# EAGLE design OpenChair (EAGLE 7.6.0)

## Sheet 1 of 2
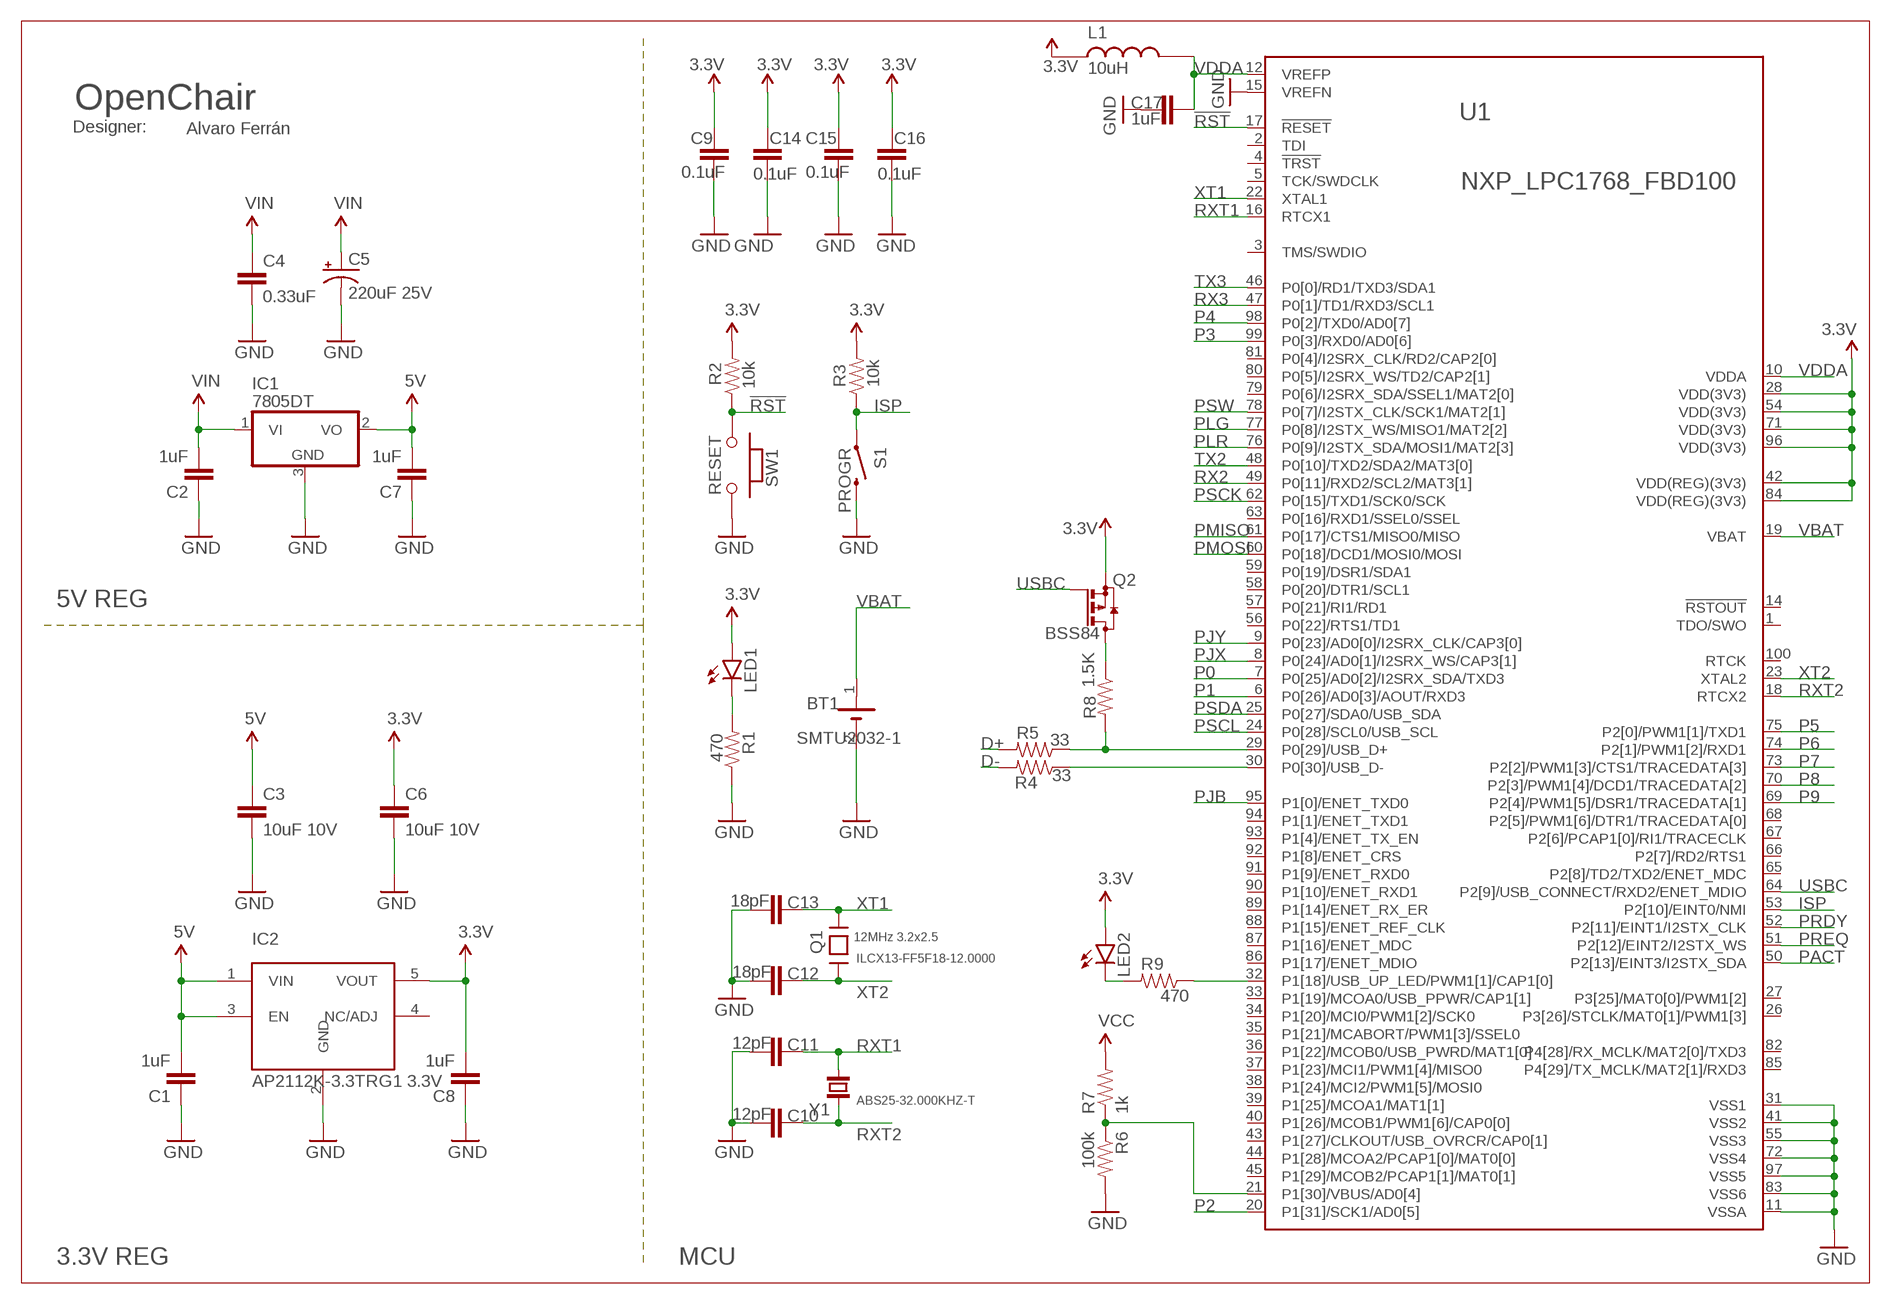
[diagram p0: schematic, sheet 1]

### Parts
BT1  SMTU2032-1  [RENATA_SMTU2032-1]
C1  1uF  CAP0603-CAP  [0603-CAP]
C2  1uF  CAP0603-CAP  [0603-CAP]
C3  10uF 10V  CAP0603-CAP  [0603-CAP]
C4  0.33uF  CAP0805  [0805]
C5  220uF 25V  CAP_POLPTH1  [CPOL-RADIAL-100UF-25V]
C6  10uF 10V  CAP0603-CAP  [0603-CAP]
C7  1uF  CAP0603-CAP  [0603-CAP]
C8  1uF  CAP0603-CAP  [0603-CAP]
C9  0.1uF  CAP0402-CAP  [0402-CAP]
C10  12pF  CAP0402-CAP  [0402-CAP]
C11  12pF  CAP0402-CAP  [0402-CAP]
C12  18pF  CAP0402-CAP  [0402-CAP]
C13  18pF  CAP0402-CAP  [0402-CAP]
C14  0.1uF  CAP0402-CAP  [0402-CAP]
C15  0.1uF  CAP0402-CAP  [0402-CAP]
C16  0.1uF  CAP0402-CAP  [0402-CAP]
C17  1uF  CAP0603-CAP  [0603-CAP]
IC1  7805DT  [TO252]
IC2  AP2112K-3.3TRG1 3.3V  5PIN_REG  [SOT23-5]
L1  10uH  L_L  [L0603]
LED1  LED0603  [LED-0603]
LED2  LED0603  [LED-0603]
Q1  12MHz 3.2x2.5  CRYSTAL3.2X2.5  [CRYSTAL_3.2X2.5]
Q2  BSS84  [SOT23]
R1  470  RESISTOR0402-RES  [0402-RES]
R2  10k  RESISTOR0402-RES  [0402-RES]
R3  10k  RESISTOR0402-RES  [0402-RES]
R4  33  RESISTOR0402-RES  [0402-RES]
R5  33  RESISTOR0402-RES  [0402-RES]
R6  100k  RESISTOR0402-RES  [0402-RES]
R7  1k  RESISTOR0402-RES  [0402-RES]
R8  1.5K  RESISTOR0402-RES  [0402-RES]
R9  470  RESISTOR0402-RES  [0402-RES]
S1  PROGR  SWITCH-MOMENTARY-2SIDE_EZ  [TACTILE-PTH-SIDEEZ]
SW1  RESET  PB157  [157SW]
U1  NXP_LPC1768_FBD100  [QFP50P1600X1600X160-100N]
Y1  ABS25  [ABS25]

### Nets
3.3V: C6.1 C8.2 C9.1 C14.1 C15.1 C16.1 IC2.5(VOUT) L1.P$1 LED1.A LED2.A Q2.2(S) R2.2 R3.2 U1.28(VDD(3V3)) U1.42(VDD(REG)(3V3)) U1.54(VDD(3V3)) U1.71(VDD(3V3)) U1.84(VDD(REG)(3V3)) U1.96(VDD(3V3)) ; also sheet 2
5V: C1.2 C3.1 C7.2 IC1.2(VO) IC2.1(VIN) IC2.3(EN) ; also sheet 2
!RST: R2.1 SW1.1 U1.17(!RESET)
D+: R5.2 ; also sheet 2
D-: R4.2 ; also sheet 2
GND: BT1.2(-) C1.1 C2.1 C3.2 C4.2 C5.2(-) C6.2 C7.1 C8.1 C9.2 C10.2 C11.2 C12.2 C13.2 C14.2 C15.2 C16.2 C17.1 IC1.3(GND) IC2.2(GND) R1.1 R6.2 S1.2 SW1.2 U1.11(VSSA) U1.15(VREFN) U1.31(VSS1) U1.41(VSS2) U1.55(VSS3) U1.72(VSS4) U1.83(VSS6) U1.97(VSS5) ; also sheet 2
ISP: R3.1 S1.1 U1.53(P2[10]/EINT0/NMI)
N$7: LED1.C R1.2
N$12: R6.1 R7.1 U1.21(P1[30]/VBUS/AD0[4])
N$13: R5.1 R8.2 U1.29(P0[29]/USB_D+)
N$14: R9.1 U1.32(P1[18]/USB_UP_LED/PWM1[1]/CAP1[0])
N$15: LED2.C R9.2
N$16: R4.1 U1.30(P0[30]/USB_D-)
N$17: Q2.3(D) R8.1
P0: U1.7(P0[25]/AD0[2]/I2SRX_SDA/TXD3) ; also sheet 2
P1: U1.6(P0[26]/AD0[3]/AOUT/RXD3) ; also sheet 2
P2: U1.20(P1[31]/SCK1/AD0[5]) ; also sheet 2
P3: U1.99(P0[3]/RXD0/AD0[6]) ; also sheet 2
P4: U1.98(P0[2]/TXD0/AD0[7]) ; also sheet 2
P5: U1.75(P2[0]/PWM1[1]/TXD1) ; also sheet 2
P6: U1.74(P2[1]/PWM1[2]/RXD1) ; also sheet 2
P7: U1.73(P2[2]/PWM1[3]/CTS1/TRACEDATA[3]) ; also sheet 2
P8: U1.70(P2[3]/PWM1[4]/DCD1/TRACEDATA[2]) ; also sheet 2
P9: U1.69(P2[4]/PWM1[5]/DSR1/TRACEDATA[1]) ; also sheet 2
PACT: U1.50(P2[13]/EINT3/I2STX_SDA) ; also sheet 2
PJB: U1.95(P1[0]/ENET_TXD0) ; also sheet 2
PJX: U1.8(P0[24]/AD0[1]/I2SRX_WS/CAP3[1]) ; also sheet 2
PJY: U1.9(P0[23]/AD0[0]/I2SRX_CLK/CAP3[0]) ; also sheet 2
PLG: U1.77(P0[8]/I2STX_WS/MISO1/MAT2[2]) ; also sheet 2
PLR: U1.76(P0[9]/I2STX_SDA/MOSI1/MAT2[3]) ; also sheet 2
PMISO: U1.61(P0[17]/CTS1/MISO0/MISO) ; also sheet 2
PMOSI: U1.60(P0[18]/DCD1/MOSI0/MOSI) ; also sheet 2
PRDY: U1.52(P2[11]/EINT1/I2STX_CLK) ; also sheet 2
PREQ: U1.51(P2[12]/EINT2/I2STX_WS) ; also sheet 2
PSCK: U1.62(P0[15]/TXD1/SCK0/SCK) ; also sheet 2
PSCL: U1.24(P0[28]/SCL0/USB_SCL) ; also sheet 2
PSDA: U1.25(P0[27]/SDA0/USB_SDA) ; also sheet 2
PSW: U1.78(P0[7]/I2STX_CLK/SCK1/MAT2[1]) ; also sheet 2
RX2: U1.49(P0[11]/RXD2/SCL2/MAT3[1]) ; also sheet 2
RX3: U1.47(P0[1]/TD1/RXD3/SCL1)
RXT1: C11.1 U1.16(RTCX1) Y1.1
RXT2: C10.1 U1.18(RTCX2) Y1.4
TX2: U1.48(P0[10]/TXD2/SDA2/MAT3[0]) ; also sheet 2
TX3: U1.46(P0[0]/RD1/TXD3/SDA1) ; also sheet 2
USBC: Q2.1(G) U1.64(P2[9]/USB_CONNECT/RXD2/ENET_MDIO)
VBAT: BT1.1(+) U1.19(VBAT)
VCC: R7.2 ; also sheet 2
VDDA: C17.2 L1.P$2 U1.10(VDDA) U1.12(VREFP)
VIN: C2.2 C4.1 C5.1(+) IC1.1(VI) ; also sheet 2
XT1: C13.1 Q1.3 U1.22(XTAL1)
XT2: C12.1 Q1.1 U1.23(XTAL2)
Unconnected: IC2.4(NC/ADJ) U1.1(TDO/SWO) U1.2(TDI) U1.3(TMS/SWDIO) U1.4(!TRST) U1.5(TCK/SWDCLK) U1.14(!RSTOUT) U1.26(P3[26]/STCLK/MAT0[1]/PWM1[3]) U1.27(P3[25]/MAT0[0]/PWM1[2]) U1.33(P1[19]/MCOA0/USB_PPWR/CAP1[1]) U1.34(P1[20]/MCI0/PWM1[2]/SCK0) U1.35(P1[21]/MCABORT/PWM1[3]/SSEL0) U1.36(P1[22]/MCOB0/USB_PWRD/MAT1[0]) U1.37(P1[23]/MCI1/PWM1[4]/MISO0) U1.38(P1[24]/MCI2/PWM1[5]/MOSI0) U1.39(P1[25]/MCOA1/MAT1[1]) U1.40(P1[26]/MCOB1/PWM1[6]/CAP0[0]) U1.43(P1[27]/CLKOUT/USB_OVRCR/CAP0[1]) U1.44(P1[28]/MCOA2/PCAP1[0]/MAT0[0]) U1.45(P1[29]/MCOB2/PCAP1[1]/MAT0[1]) U1.56(P0[22]/RTS1/TD1) U1.57(P0[21]/RI1/RD1) U1.58(P0[20]/DTR1/SCL1) U1.59(P0[19]/DSR1/SDA1) U1.63(P0[16]/RXD1/SSEL0/SSEL) U1.65(P2[8]/TD2/TXD2/ENET_MDC) U1.66(P2[7]/RD2/RTS1) U1.67(P2[6]/PCAP1[0]/RI1/TRACECLK) U1.68(P2[5]/PWM1[6]/DTR1/TRACEDATA[0]) U1.79(P0[6]/I2SRX_SDA/SSEL1/MAT2[0]) U1.80(P0[5]/I2SRX_WS/TD2/CAP2[1]) U1.81(P0[4]/I2SRX_CLK/RD2/CAP2[0]) U1.82(P4[28]/RX_MCLK/MAT2[0]/TXD3) U1.85(P4[29]/TX_MCLK/MAT2[1]/RXD3) U1.86(P1[17]/ENET_MDIO) U1.87(P1[16]/ENET_MDC) U1.88(P1[15]/ENET_REF_CLK) U1.89(P1[14]/ENET_RX_ER) U1.90(P1[10]/ENET_RXD1) U1.91(P1[9]/ENET_RXD0) U1.92(P1[8]/ENET_CRS) U1.93(P1[4]/ENET_TX_EN) U1.94(P1[1]/ENET_TXD1) U1.100(RTCK)

### Notes on the sheet
- OpenChair
- Designer: | Alvaro Ferrán
- 5V REG
- ILCX13-FF5F18-12.0000
- ABS25-32.000KHZ-T
- 3.3V REG | MCU

## Sheet 2 of 2
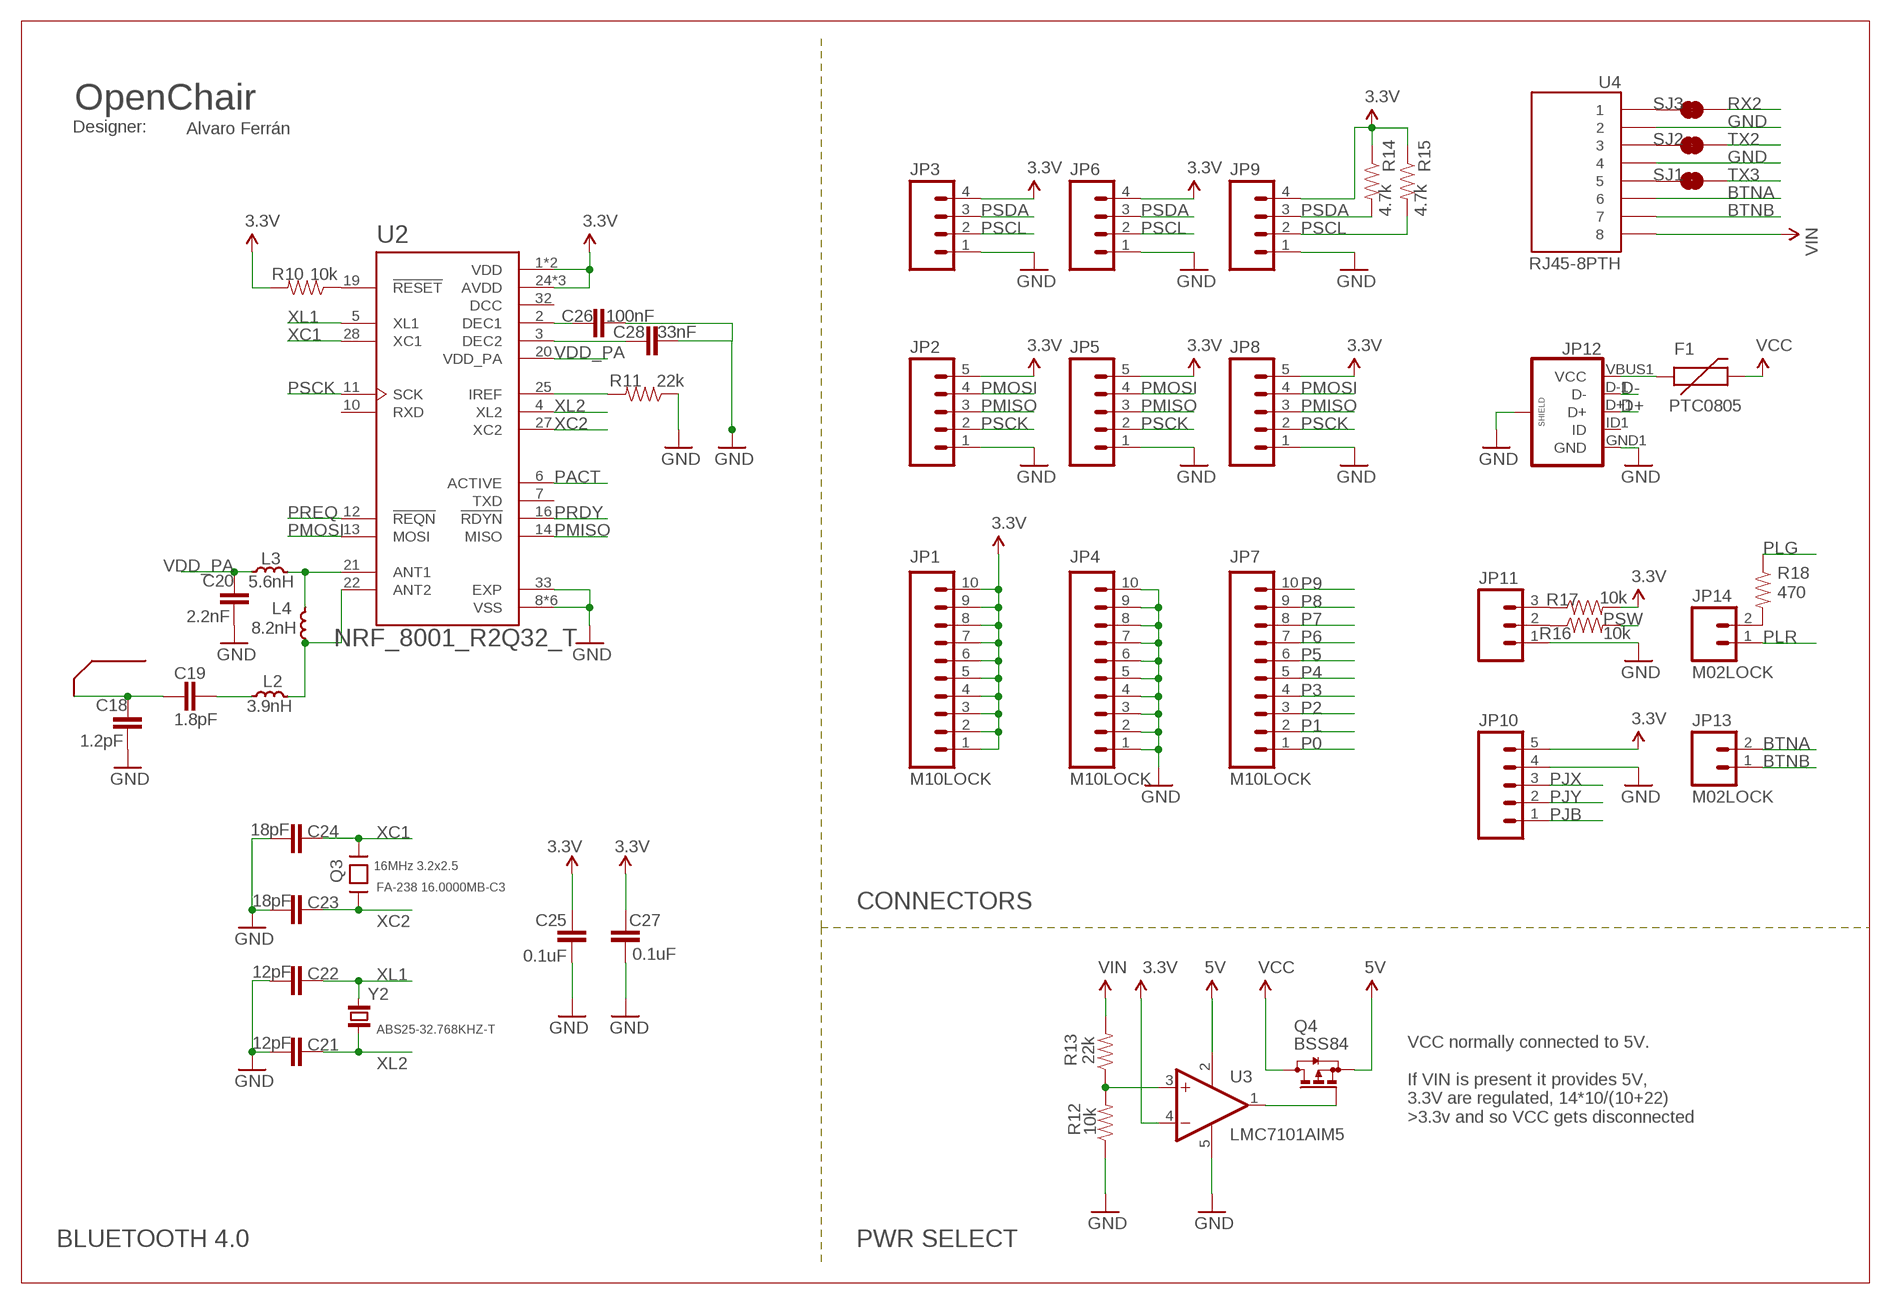
[diagram p1: schematic, sheet 2]

### Parts
ANT1  NRF_ANTENNA  [NRF_ANTENNA]
C18  1.2pF  CAP0402-CAP  [0402-CAP]
C19  1.8pF  CAP0402-CAP  [0402-CAP]
C20  2.2nF  CAP0402-CAP  [0402-CAP]
C21  12pF  CAP0402-CAP  [0402-CAP]
C22  12pF  CAP0402-CAP  [0402-CAP]
C23  18pF  CAP0402-CAP  [0402-CAP]
C24  18pF  CAP0402-CAP  [0402-CAP]
C25  0.1uF  CAP0402-CAP  [0402-CAP]
C26  100nF  CAP0402-CAP  [0402-CAP]
C27  0.1uF  CAP0402-CAP  [0402-CAP]
C28  33nF  CAP0402-CAP  [0402-CAP]
F1  PTC0805  [0805]
JP1  M10LOCK  [1X10_LOCK]
JP2  M05LOCK  [1X05_LOCK]
JP3  M04LOCK  [1X04_LOCK]
JP4  M10LOCK  [1X10_LOCK]
JP5  M05LOCK  [1X05_LOCK]
JP6  M04LOCK  [1X04_LOCK]
JP7  M10LOCK  [1X10_LOCK]
JP8  M05LOCK  [1X05_LOCK]
JP9  M04LOCK  [1X04_LOCK]
JP10  M05LOCK  [1X05_LOCK]
JP11  M03LOCK  [1X03_LOCK]
JP12  USB_MICROB_PLUGCONN-11752  [USB-B-MICRO-SMD_V03]
JP13  M02LOCK  [1X02_LOCK]
JP14  M02LOCK  [1X02_LOCK]
L2  3.9nH  L0402  [0402]
L3  5.6nH  L0402  [0402]
L4  8.2nH  L0402  [0402]
Q3  16MHz 3.2x2.5  CRYSTAL3.2X2.5  [CRYSTAL_3.2X2.5]
Q4  BSS84  [SOT23]
R10  10k  RESISTOR0402-RES  [0402-RES]
R11  22k  RESISTOR0402-RES  [0402-RES]
R12  10k  RESISTOR0402-RES  [0402-RES]
R13  22k  RESISTOR0402-RES  [0402-RES]
R14  4.7k  RESISTOR0402-RES  [0402-RES]
R15  4.7k  RESISTOR0402-RES  [0402-RES]
R16  10k  RESISTOR0402-RES  [0402-RES]
R17  10k  RESISTOR0402-RES  [0402-RES]
R18  470  RESISTOR0402-RES  [0402-RES]
SJ1  JUMPER-PAD-2-NC_BY_TRACE  [PAD-JUMPER-2-NC_BY_TRACE_YES_SILK]
SJ2  JUMPER-PAD-2-NC_BY_TRACE  [PAD-JUMPER-2-NC_BY_TRACE_YES_SILK]
SJ3  JUMPER-PAD-2-NC_BY_TRACE  [PAD-JUMPER-2-NC_BY_TRACE_YES_SILK]
U2  NRF_8001_R2Q32_T  [QFN50P500X500X90-33N]
U3  LMC7101AIM5  [SOT23-5]
U4  RJ45-8PTH  [RJ45-8]
Y2  ABS25-32.768kHz  ABS25  [ABS25]

### Nets
3.3V: C25.1 C27.1 JP1.1 JP1.2 JP1.3 JP1.4 JP1.5 JP1.6 JP1.7 JP1.8 JP1.9 JP1.10 JP2.5 JP3.4 JP5.5 JP6.4 JP8.5 JP9.4 JP10.5 R10.2 R14.1 R15.1 R17.2 U2.1(VDD) U2.9(VDD) U2.24(AVDD) U2.26(AVDD) U2.29(AVDD) U3.4(-IN) ; also sheet 1
5V: Q4.2(S) U3.2(V+) ; also sheet 1
BTNA: JP13.2 U4.6
BTNB: JP13.1 U4.7
D+: JP12.D+1(D+) ; also sheet 1
D-: JP12.D-1(D-) ; also sheet 1
GND: C18.2 C20.2 C21.2 C22.2 C23.2 C24.2 C25.2 C26.1 C27.2 C28.1 JP2.1 JP3.1 JP4.1 JP4.2 JP4.3 JP4.4 JP4.5 JP4.6 JP4.7 JP4.8 JP4.9 JP4.10 JP5.1 JP6.1 JP8.1 JP9.1 JP10.4 JP11.1 JP12.GND1(GND) JP12.SHIELD1(SHIELD) JP12.SHIELD2(SHIELD) JP12.SHIELD3(SHIELD) R11.1 R12.1 U2.8(VSS) U2.17(VSS) U2.18(VSS) U2.23(VSS) U2.30(VSS) U2.31(VSS) U2.33(EXP) U3.5(V-) U4.2 U4.4 ; also sheet 1
N$1: JP14.2 R18.2
N$2: SJ3.1 U4.1
N$3: SJ2.1 U4.3
N$4: SJ1.1 U4.5
N$5: F1.1 JP12.VBUS1(VCC)
N$6: JP11.2 R16.1
N$11: JP11.3 R17.1
N$18: Q4.1(G) U3.1(OUT)
N$20: R12.2 R13.1 U3.3(+IN)
N$21: R11.2 U2.25(IREF)
N$22: C26.2 U2.2(DEC1)
N$23: C28.2 U2.3(DEC2)
N$24: R10.1 U2.19(!RESET)
N$25: L2.2 L4.1 U2.22(ANT2)
N$26: L3.2 L4.2 U2.21(ANT1)
N$29: C19.1 L2.1
N$30: ANT1.P$1 C18.1 C19.2
P0: JP7.1 ; also sheet 1
P1: JP7.2 ; also sheet 1
P2: JP7.3 ; also sheet 1
P3: JP7.4 ; also sheet 1
P4: JP7.5 ; also sheet 1
P5: JP7.6 ; also sheet 1
P6: JP7.7 ; also sheet 1
P7: JP7.8 ; also sheet 1
P8: JP7.9 ; also sheet 1
P9: JP7.10 ; also sheet 1
PACT: U2.6(ACTIVE) ; also sheet 1
PJB: JP10.1 ; also sheet 1
PJX: JP10.3 ; also sheet 1
PJY: JP10.2 ; also sheet 1
PLG: R18.1 ; also sheet 1
PLR: JP14.1 ; also sheet 1
PMISO: JP2.3 JP5.3 JP8.3 U2.14(MISO) ; also sheet 1
PMOSI: JP2.4 JP5.4 JP8.4 U2.13(MOSI) ; also sheet 1
PRDY: U2.16(!RDYN) ; also sheet 1
PREQ: U2.12(!REQN) ; also sheet 1
PSCK: JP2.2 JP5.2 JP8.2 U2.11(SCK) ; also sheet 1
PSCL: JP3.2 JP6.2 JP9.2 R15.2 ; also sheet 1
PSDA: JP3.3 JP6.3 JP9.3 R14.2 ; also sheet 1
PSW: R16.2 ; also sheet 1
RX2: SJ3.2 ; also sheet 1
TX2: SJ2.2 ; also sheet 1
TX3: SJ1.2 ; also sheet 1
VCC: F1.2 Q4.3(D) ; also sheet 1
VDD_PA: C20.1 L3.1 U2.20(VDD_PA)
VIN: R13.2 U4.8 ; also sheet 1
XC1: C24.1 Q3.3 U2.28(XC1)
XC2: C23.1 Q3.1 U2.27(XC2)
XL1: C22.1 U2.5(XL1) Y2.4
XL2: C21.1 U2.4(XL2) Y2.1
Unconnected: JP12.ID1(ID) U2.7(TXD) U2.10(RXD)

### Notes on the sheet
- OpenChair
- Designer: | Alvaro Ferrán
- FA-238 16.0000MB-C3
- CONNECTORS
- ABS25-32.768KHZ-T
- VCC normally connected to 5V.
  
  If VIN is present it provides 5V, 
  3.3V are regulated, 14*10/(10+22)
  >3.3v and so VCC gets disconnected
- BLUETOOTH 4.0 | PWR SELECT

## Power pins joined to a net without a drawn wire
DCC: U2.32(DCC)

## Library data of the parts
ANT1 = alvaroferran:NRF_ANTENNA
BT1 = alvaroferran:SMTU2032-1: Battery Renata Battery Holder; AVAILABILITY: Good; DESCRIPTION: Surface Mount CR2032 Battery Holder Tape and Reel; MF: Renata; MP: SMTU2032-LF.TR; PACKAGE: None; PRICE: 0.81 USD
C1-C4 C6-C28 = SparkFun-Passives:CAP: Capacitor Standard 0603 ceramic capacitor, and 0.1" leaded capacitor.
C5 = SparkFun-Capacitors:CAP_POL: Capacitor Polarized These are standard SMD and PTH capacitors. Normally 10uF, 47uF, and 100uF in electrolytic and tantalum varieties. Always verify the external diameter of the through hole cap, it varies with capacity, voltage, and manufacturer. The EIA devices should be standard.
F1 = pighiXXX:PTC0805
IC1 = linear:78*: Positive VOLTAGE REGULATOR Source: http://cache.national.com/ds/LM/LM78L05.pdf http://www.fairchildsemi.com/ds/LM/LM7805.pdf
IC2 = GHI:5PIN_REG
JP1 JP4 JP7 = SparkFun-Connectors:M10: Header 10 Standard 10-pin 0.1" header. Use with straight break away headers (SKU : PRT-00116), right angle break away headers (PRT-00553), swiss pins (PRT-00743), machine pins (PRT-00117), and female headers (PRT-00115).
JP2 JP5 JP8 JP10 = SparkFun-Connectors:M05: Header 5 Standard 5-pin 0.1" header. Use with straight break away headers (SKU : PRT-00116), right angle break away headers (PRT-00553), swiss pins (PRT-00743), machine pins (PRT-00117), and female headers (PRT-00115). Molex polarized connector foot print use with SKU : PRT-08230 with associated crimp pins and housings.
JP3 JP6 JP9 = SparkFun-Connectors:M04: Header 4 Standard 4-pin 0.1" header. Use with straight break away headers (SKU : PRT-00116), right angle break away headers (PRT-00553), swiss pins (PRT-00743), machine pins (PRT-00117), and female headers (PRT-00115). Molex polarized connector foot print use with SKU : PRT-08231 with associated crimp pins and housings. 1MM SMD Version SKU: PRT-10208
JP11 = SparkFun-Connectors:M03: Header 3 Standard 3-pin 0.1" header. Use with straight break away headers (SKU : PRT-00116), right angle break away headers (PRT-00553), swiss pins (PRT-00743), machine pins (PRT-00117), and female headers (PRT-00115). Molex polarized connector foot print use with SKU : PRT-08232 with associated crimp pins and housings.
JP12 = SparkFun-Connectors:USB_MICROB_PLUG: USB Micro-B connectors Some male, some female. Watch your step!; PROD_ID: CONN-11752
JP13 JP14 = SparkFun-Connectors:M02: Standard 2-pin 0.1" header. Use with - straight break away headers ( PRT-00116) - right angle break away headers (PRT-00553) - swiss pins (PRT-00743) - machine pins (PRT-00117) - female headers (PRT-00115) Molex polarized connector foot print use with: PRT-08233 with associated crimp pins and housings. 2.54_SCREWTERM for use with PRT-10571. 3.5mm Screw Terminal footprints for PRT-08084 5mm Screw Terminal footprints for use with PRT-08432
L1 = mbed:L
L2-L4 = mbed-HDK:L: Inductor
LED1 LED2 = SparkFun-LED:LED: LEDs Standard schematic elements and footprints for 5mm, 3mm, 1206, and 0603 sized LEDs. 5mm - Spark Fun Electronics SKU : COM-00529 (and others)
Q1 Q3 = GHI:CRYSTAL3.2X2.5
Q2 Q4 = transistor-small-signal:BSS84: P-CHANNEL MOS FET
R1-R18 = SparkFun-Passives:RESISTOR: Resistor Basic schematic elements and footprints for 0603, 1206, and PTH resistors.
S1 = SparkFun-Electromechanical:SWITCH-MOMENTARY-2: Various NO switches- pushbuttons, reed, etc
SJ1-SJ3 = SparkFun-Passives:JUMPER-PAD-2-NC_BY_TRACE
SW1 = MySMD:PB157
U1 = alvaroferran:NXP_LPC1768_FBD100: LPC1768 Series 64 kB 100 MHz 32-Bit ARM Cortex M3 Microcontroller - LQFP-100; AVAILABILITY: Good; DESCRIPTION: LPC1768 Series 64 kB 100 MHz 32-Bit ARM Cortex M3 Microcontroller - LQFP-100; MF: NXP Semiconductors; MP: LPC1768FBD100,551; PACKAGE: LQFP-100 NXP Semiconductors; PRICE: 7.79 USD
U2 = alvaroferran:NRF_8001_R2Q32_T: Bluetooth Class II 3V 1Mbps 32-Pin QFN EP Tray; AVAILABILITY: Good; DESCRIPTION: Bluetooth Class II 3V 1Mbps 32-Pin QFN EP Tray; MF: Nordic Semiconductor; MP: NRF8001-R2Q32-T; PACKAGE: QFN-32 Nordic Semiconductor; PRICE: 2.52 USD
U3 = linear:LMC7101AIM5
U4 = SparkFun-Connectors:RJ45-8: RJ45 Jack Simple RJ45, 8-pin connection - connector for common Cat5, Cat5e, and Cat6 Ethernet cables. Footprint not yet proven in production. Connector sku is PRT-00643; Breakout PCB sku is BOB-00716.
Y1 Y2 = alvaroferran:ABS25: CRYSTAL - ABRACON 8.0 x 3.8 mm; AVAILABILITY: Good; DESCRIPTION: Crystal, Plastic Molded 32.000KHZ, 12.5pF, 20ppm-40+85C, 8 x 3.8 x 2.5; MF: Abracon; MP: ABS25-32.000KHZ-T; PACKAGE: None; PRICE: 0.78 USD

## Net classes
0 default: width 0.254 mm, drill 0.254 mm, clearance 0.203 mm

## Board
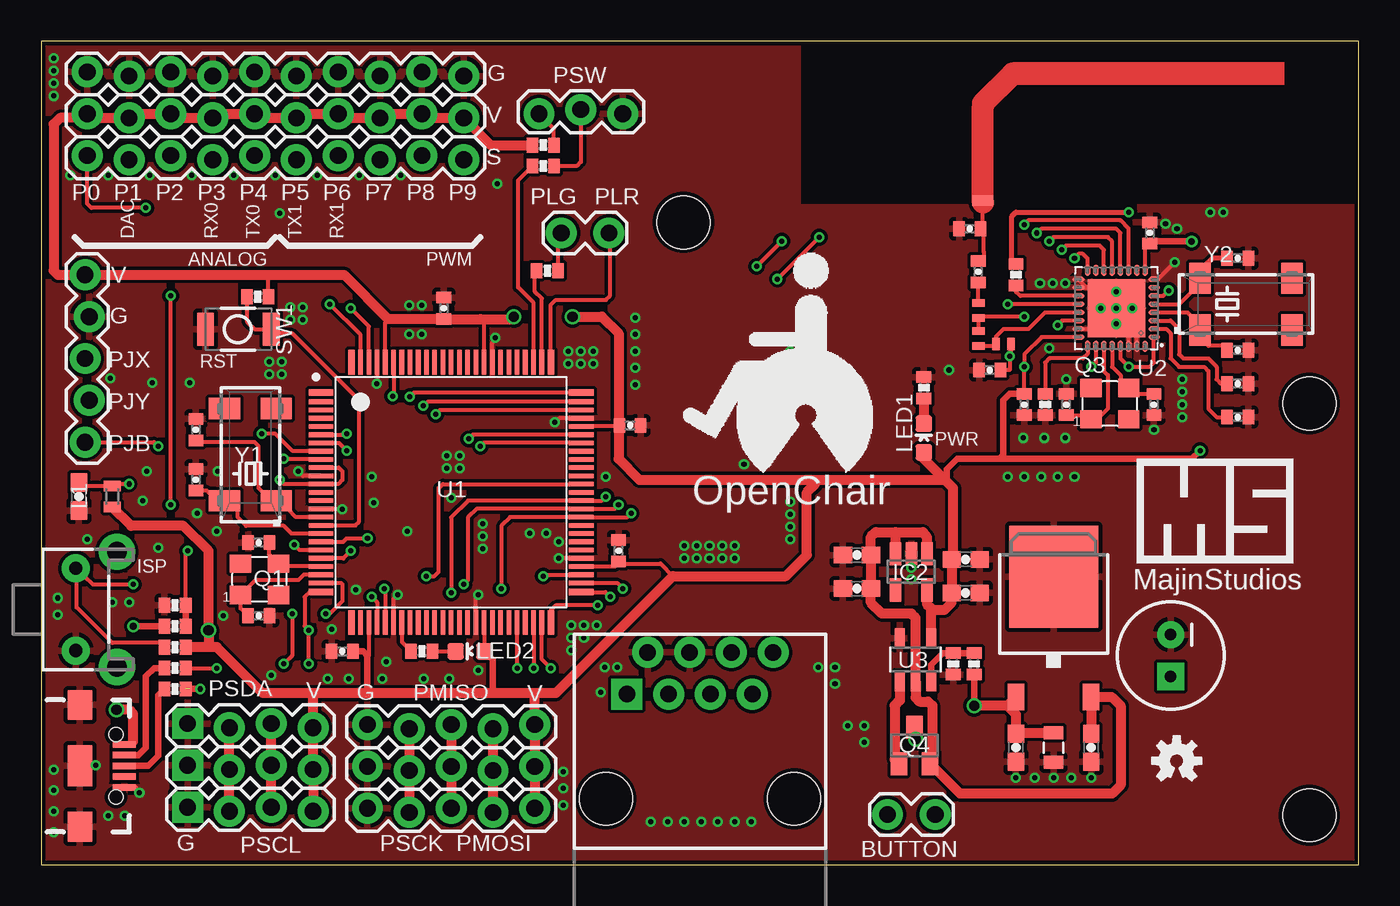
[diagram p2: board, top side]
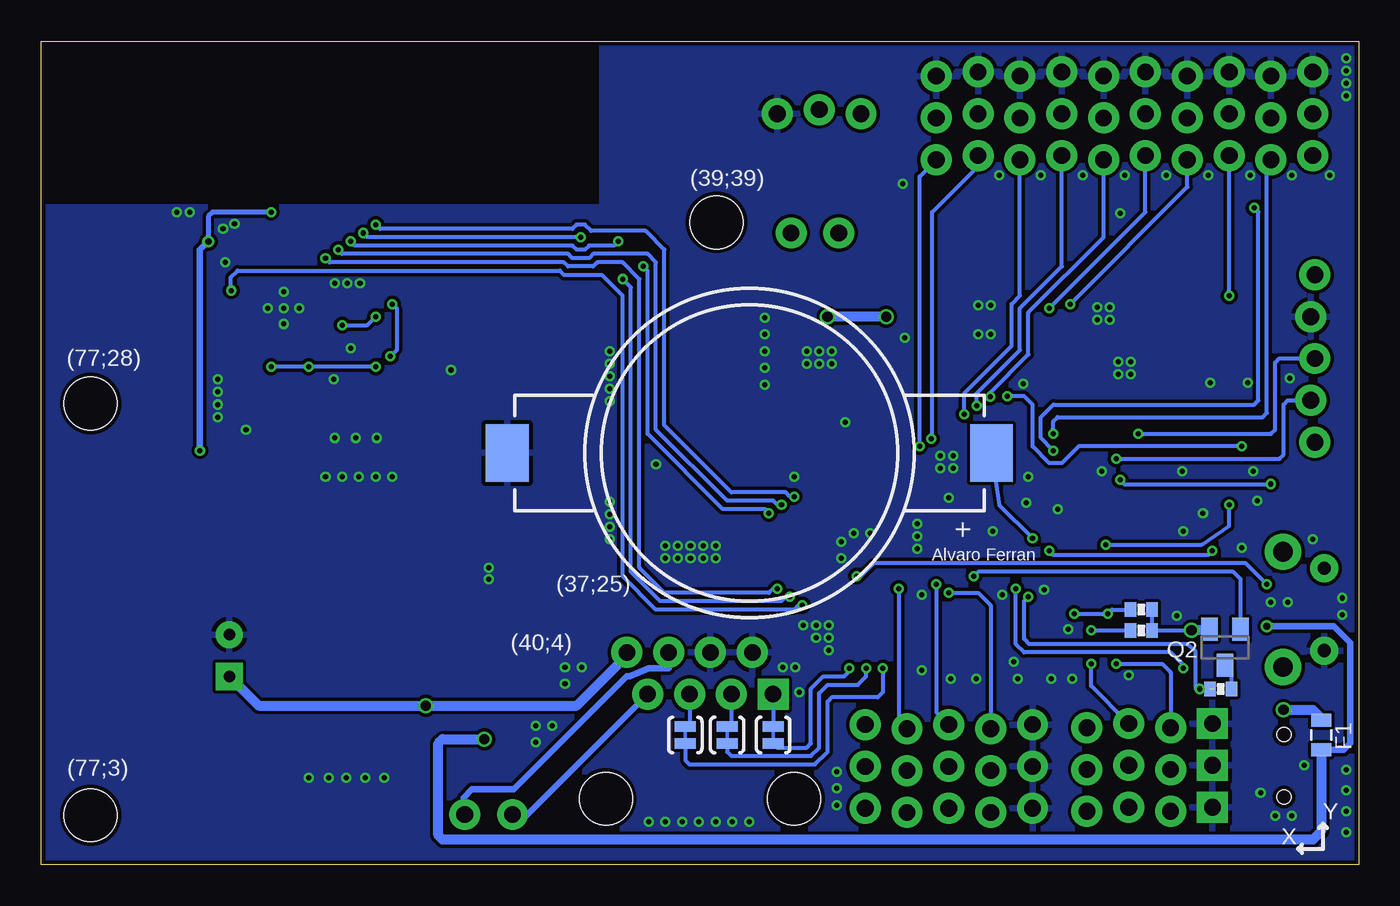
[diagram p3: board, bottom side, seen from below]

Size 80 x 50 mm. Coordinates in mm from the lower left corner, seen from the top.
Outline: 0,0 80,0 80,50 0,50 0,0
Copper layers (1*16): Top 0.035mm / dielectric 1.5mm / Bottom 0.035mm
Design rules "pighixxx_CAM_DRC_V1.0": minimum track width 6mil, minimum drill 12mil, track to track 6mil, track to pad 6mil, pad to pad 6mil, via to via 6mil, smd to smd 0mil, copper to edge 10mil, drill to drill 10mil, minimum pad ring 10mil, minimum via ring 6mil, stop-mask expansion 2mil, vias tented up to drill 100mil, thermal gap 10mil
Holes 3.2 mm at 77,3 77,28 39,39

### Footprints (pad centres in the part's own frame; a part is rotated, then mirrored left to right if it is on the bottom)
NRF_ANTENNA = smd 1.27 x 0.635: P$1 0.02,0.189
RENATA_SMTU2032-1 = smd 2.6 x 3.5: 1 -14.7,0; 2 14.7,0
0603-CAP = smd 1.1 x 1: 1 -0.85,0; 2 0.85,0
0805 = smd 0.8 x 1.2: 1 -0.9,0; 2 0.9,0
CPOL-RADIAL-100UF-25V = drill 0.7 pad 1.651 square: 1 1.27,0 | drill 0.7 pad 1.651: 2 -1.27,0
0402-CAP = smd 0.7 x 0.9: 1 -0.65,0; 2 0.65,0
TO252 = smd 1 x 1.6: 1 -2.28,-4.8; 2 2.28,-4.8 | smd 5.4 x 6.2: 3 0,2.5
SOT23-5 = smd 0.7 x 1.4: 1 0.95,1.1; 2 0,1.1; 3 -0.95,1.1; 4 -0.95,-1.1; 5 0.95,-1.1
1X10_LOCK = drill 1.016 pad 1.88: 1 0,0.127; 2 2.54,-0.127; 3 5.08,0.127; 4 7.62,-0.127; 5 10.16,0.127; 6 12.7,-0.127; 7 15.24,0.127; 8 17.78,-0.127; 9 20.32,0.127; 10 22.86,-0.127
1X05_LOCK = drill 1.016 pad 1.88: 1 0,0.127; 2 2.54,-0.127; 3 5.08,0.127; 4 7.62,-0.127; 5 10.16,0.127
1X04_LOCK = drill 1.016 pad 1.88 square: 1 0,0.127 | drill 1.016 pad 1.88: 2 2.54,-0.127; 3 5.08,0.127; 4 7.62,-0.127
1X03_LOCK = drill 1.016 pad 1.88: 1 0,0.127; 2 2.54,-0.127; 3 5.08,0.127
USB-B-MICRO-SMD_V03 = smd 1.4 x 0.4: D+1 2.7,0; D-1 2.7,0.65; GND1 2.7,-1.3; ID1 2.7,-0.65; VBUS1 2.7,1.3 | smd 1.5 x 1.8: SHIELD1 0,3.7; SHIELD2 0,-3.7 | smd 1.5 x 2.5: SHIELD3 0,0 | hole 0.85: 2.2,1.9; 2.2,-1.9
1X02_LOCK = drill 1.016 pad 1.88: 1 -0.178,0; 2 2.718,0
L0603 = smd 0.635 x 1.016: P$1 -0.635,0; P$2 0.635,0
0402 = smd 0.457 x 0.762: 1 -0.457,0; 2 0.457,0
LED-0603 = smd 1 x 1: A 0,-0.877; C 0,0.877
CRYSTAL_3.2X2.5 = smd 1.3 x 1.1: 1 -1.1,-0.9; 2 1.2,-0.9; 3 1.2,1; 4 -1.1,1
SOT23 = smd 1 x 1.4: 1 -0.95,-1.1; 2 0.95,-1.1; 3 0,1.1
0402-RES = smd 0.7 x 0.9: 1 -0.65,0; 2 0.65,0
TACTILE-PTH-SIDEEZ = drill 0.8 pad 1.7: 1 -2.5,0; 2 2.5,0 | drill 1.2 pad 2.2: ANCHOR1 -3.5,2.5; ANCHOR2 3.5,2.5
PAD-JUMPER-2-NC_BY_TRACE_YES_SILK = smd 0.635 x 1.27: 1 -0.508,0; 2 0.508,0
157SW = smd 1.016 x 1.981: 1 0,0; 2 4,0
QFP50P1600X1600X160-100N = smd 1.5 x 0.4: 1 -7.9,6.06; 25 -7.9,-6.06; 51 7.9,-6.06; 75 7.9,6.06 | smd 1.5 x 0.28: 2 -7.9,5.5; 3 -7.9,5; 4 -7.9,4.5; 5 -7.9,4; 6 -7.9,3.5; 7 -7.9,3; 8 -7.9,2.5; 9 -7.9,2; 10 -7.9,1.5; 11 -7.9,1; 12 -7.9,0.5; 13 -7.9,0; 14 -7.9,-0.5; 15 -7.9,-1; 16 -7.9,-1.5; 17 -7.9,-2; 18 -7.9,-2.5; 19 -7.9,-3; 20 -7.9,-3.5; 21 -7.9,-4; 22 -7.9,-4.5; 23 -7.9,-5; 24 -7.9,-5.5; 52 7.9,-5.5; 53 7.9,-5; 54 7.9,-4.5; 55 7.9,-4; 56 7.9,-3.5; 57 7.9,-3; 58 7.9,-2.5; 59 7.9,-2; 60 7.9,-1.5; 61 7.9,-1; 62 7.9,-0.5; 63 7.9,0; 64 7.9,0.5; 65 7.9,1; 66 7.9,1.5; 67 7.9,2; 68 7.9,2.5; 69 7.9,3; 70 7.9,3.5; 71 7.9,4; 72 7.9,4.5; 73 7.9,5; 74 7.9,5.5 | smd 0.4 x 1.5: 26 -6.06,-7.9; 50 6.06,-7.9; 76 6.06,7.9; 100 -6.06,7.9 | smd 0.28 x 1.5: 27 -5.5,-7.9; 28 -5,-7.9; 29 -4.5,-7.9; 30 -4,-7.9; 31 -3.5,-7.9; 32 -3,-7.9; 33 -2.5,-7.9; 34 -2,-7.9; 35 -1.5,-7.9; 36 -1,-7.9; 37 -0.5,-7.9; 38 0,-7.9; 39 0.5,-7.9; 40 1,-7.9; 41 1.5,-7.9; 42 2,-7.9; 43 2.5,-7.9; 44 3,-7.9; 45 3.5,-7.9; 46 4,-7.9; 47 4.5,-7.9; 48 5,-7.9; 49 5.5,-7.9; 77 5.5,7.9; 78 5,7.9; 79 4.5,7.9; 80 4,7.9; 81 3.5,7.9; 82 3,7.9; 83 2.5,7.9; 84 2,7.9; 85 1.5,7.9; 86 1,7.9; 87 0.5,7.9; 88 0,7.9; 89 -0.5,7.9; 90 -1,7.9; 91 -1.5,7.9; 92 -2,7.9; 93 -2.5,7.9; 94 -3,7.9; 95 -3.5,7.9; 96 -4,7.9; 97 -4.5,7.9; 98 -5,7.9; 99 -5.5,7.9
QFN50P500X500X90-33N = smd 0.7 x 0.3: 1 -2.3,1.75; 2 -2.3,1.25; 3 -2.3,0.75; 4 -2.3,0.25; 5 -2.3,-0.25; 6 -2.3,-0.75; 7 -2.3,-1.25; 8 -2.3,-1.75; 17 2.3,-1.75; 18 2.3,-1.25; 19 2.3,-0.75; 20 2.3,-0.25; 21 2.3,0.25; 22 2.3,0.75; 23 2.3,1.25; 24 2.3,1.75 | smd 0.3 x 0.7: 9 -1.75,-2.3; 10 -1.25,-2.3; 11 -0.75,-2.3; 12 -0.25,-2.3; 13 0.25,-2.3; 14 0.75,-2.3; 15 1.25,-2.3; 16 1.75,-2.3; 25 1.75,2.3; 26 1.25,2.3; 27 0.75,2.3; 28 0.25,2.3; 29 -0.25,2.3; 30 -0.75,2.3; 31 -1.25,2.3; 32 -1.75,2.3 | smd 3.5 x 3.5: 33 0,0
SOT23-5' = smd 0.6 x 1.2: 1 -0.95,-1.306; 2 0,-1.306; 3 0.95,-1.306; 4 0.95,1.306; 5 -0.95,1.306
RJ45-8 = drill 1 pad 1.88 square: 1 -4.445,6.35 | drill 1 pad 1.88: 2 -3.175,8.89; 3 -1.905,6.35; 4 -0.635,8.89; 5 0.635,6.35; 6 1.905,8.89; 7 3.175,6.35; 8 4.445,8.89 | hole 3.2: -5.715,0; 5.715,0
ABS25 = smd 1.3 x 1.9: 1 -2.794,-1.574; 2 2.794,-1.574; 3 2.794,1.574; 4 -2.794,1.574

### Placement (x,y rotation side)
ANT1  57.15,40.13 0 top
BT1  37,25 180 bottom
C1  49.53,18.8 0 top
C2  59.18,7.11 90 top
C3  49.53,16.76 180 top
C4  61.47,7.11 270 top
C5  68.58,12.7 270 top
C6  56.13,18.54 0 top
C7  63.75,7.11 90 top
C8  56.13,16.51 180 top
C9  35.05,19.05 90 top
C10  9.4,23.37 90 top
C11  9.4,26.42 90 top
C12  13.21,15.11 0 top
C13  13.21,19.56 180 top
C14  18.29,12.95 180 top
C15  35.75,26.67 0 top
C16  24.45,33.78 90 top
C17  2.29,22.35 90 top
C18  56.39,38.61 180 top
C19  56.9,36 90 top
C20  57.59,30.04 180 top
C21  72.64,31.24 0 top
C22  72.64,36.83 0 top
C23  62.23,27.94 90 top
C24  67.56,27.94 270 top
C25  59.69,27.94 270 top
C26  72.64,27.18 180 top
C27  67.31,38.35 90 top
C28  72.64,29.21 180 top
F1  2.29,7.87 270 bottom
IC1  61.47,14.99 0 top
IC2  52.83,17.78 0 top
JP1  2.79,45.47 0 top
JP2  19.81,8.38 0 top
JP3  8.89,8.45 0 top
JP4  2.79,48.01 0 top
JP5  19.81,5.84 0 top
JP6  8.89,5.91 0 top
JP7  2.79,42.93 0 top
JP8  19.81,3.3 0 top
JP9  8.89,3.37 0 top
JP10  2.79,25.65 90 top
JP11  35.31,45.72 180 top
JP12  2.35,6 0 top
JP13  51.56,3.05 0 top
JP14  34.29,38.35 180 top
L1  4.32,22.35 90 top
L2  56.9,33.66 270 top
L3  58.42,31.62 180 top
L4  56.9,31.94 270 top
LED1  53.59,25.91 0 top
LED2  26.04,12.95 90 top
Q1  13.21,17.27 0 top
Q2  8.13,13.21 180 bottom
Q3  64.83,27.94 0 top
Q4  53.02,7.24 0 top
R1  53.59,28.96 270 top
R2  13.14,34.48 0 top
R3  8.13,13.21 0 top
R4  8.13,11.94 180 top
R5  8.13,10.67 180 top
R6  8.13,15.75 180 top
R7  8.13,14.48 180 top
R8  8.38,10.67 180 bottom
R9  23.11,12.95 0 top
R10  59.18,35.81 90 top
R11  60.96,27.94 90 top
R12  55.37,12.19 90 top
R13  56.64,12.19 270 top
R14  13.21,14.22 180 bottom
R15  13.21,15.49 180 bottom
R16  30.48,42.42 180 top
R17  30.48,43.69 180 top
R18  30.73,36.07 0 top
S1  2.1,15.5 270 top
SJ1  40.89,7.87 270 bottom
SJ2  38.35,7.87 270 bottom
SJ3  35.56,7.87 270 bottom
SW1  13.97,32.51 180 top
U1  24.89,22.61 0 top
U2  65.28,33.78 180 top
U3  LMC7101AIM5  [SOT23-5']  53.09,12.45 0 top
U4  40,4 0 top
U$1  [MAJINSTUDIOS]  71.3,21.51 0 top
U$2  [OPENCHAIR2]  46.38,27.2 0 top
U$3  [OSHW-LOGO-S]  68.94,6.3 0 top
Y1  12.7,24.89 90 top
Y2  73.15,34.04 0 top

### Tracks (layer width: path | path; a pad name or v marks a point on that pad's centre or on a via)
3.3V  (via drill 0.3, 0.41, 0.61)
  Top 0.254: U2.29 65.53,30.74 v66.04,30.23 67.31,30.23 67.56,30.48 67.56,32.02 U2.1 | U2.26 64.03,30.5 v63.75,30.23 | 67.03,37.96 C27.1 67.03,37.68 U2.9 | C25.1 v59.69,30.23 59.69,30.99 60.73,32.03 U2.24 | U1.42 26.89,12.97 LED2.A | 19.89,10.49 19.3,10.41 | U1.54 34.84,18.11 C9.1 35.07,18.27 37.61,18.27 38.35,17.53 | U1.96 20.89,32.94 21.08,33.13 | U1.84 26.89,32.91 26.67,33.13 | R2.2 13.79,35.74 13.72,35.81 | 35.05,26.72 34.94,26.61 U1.71 | U1.28 19.89,12.7 19.81,12.7
  Top 0.305: v66.04,39.62 59.18,39.62 58.93,39.37 58.93,36.46 R10.2
  Top 0.406: C27.1 67.42,37.85 v69.85,37.85 | v70.36,25.15 69.85,24.64 58.17,24.64 | 58.17,24.64 55.63,24.64 54.99,24 54.99,23.24 | C25.1 58.82,28.59 58.42,28.19 58.42,24.89 58.17,24.64 | 26.91,10.43 26.92,10.41 | LED2.A 27.43,12.43 27.43,10.41 | C14.1 19.56,12.95 19.81,12.7 19.81,10.57 19.89,10.49
  Top 0.61: IC2.5 53.78,15.81 54.04,15.56 | 54.04,15.56 54.1,15.49 54.86,15.49 55.28,15.91 C8.2 C6.1 55.37,18.63 55.37,22.86 54.99,23.24 54.86,23.37 | U3.4 54.04,15.56 | JP8.5 JP5.5 JP2.5 29.97,10.41 | JP1.1 3.05,45.34 | 3.05,45.34 JP1.2 5.59,45.59 JP1.3 8.13,45.34 JP1.4 10.67,45.59 JP1.5 13.21,45.34 JP1.6 15.75,45.59 JP1.7 18.29,45.34 JP1.8 20.83,45.59 JP1.9 23.37,45.34 JP1.10 27.3,43.69 R17.2 | 29.97,10.41 31.24,10.41 38.35,17.53 45.21,17.53 46.48,18.8 46.48,22.61 46.99,23.11 46.99,23.37 | 29.97,10.41 27.43,10.41 26.92,10.41 19.3,10.41 16.51,10.41 | 16.51,10.41 13.46,10.41 10.67,13.21 10.16,13.21 | 16.51,10.41 JP3.4 JP6.4 JP9.4 | 10.16,13.21 R3.2 | 10.16,13.21 v10.16,14.22 10.16,19.05 8.64,20.57 5.46,20.57 L1.P$1 | 3.05,45.34 1.14,45.34 0.76,44.96 0.76,36.07 1.02,35.81 JP10.5 13.72,35.81 18.4,35.81 21.08,33.13 C16.1 26.67,33.13 28.56,33.13 v28.7,33.27 | 35.05,26.72 35.05,32.26 34.04,33.27 v32.26,33.27 | 35.05,26.72 C15.1 | 35.05,26.72 35.05,24.64 36.32,23.37 46.99,23.37 | 46.99,23.37 54.86,23.37 | LED1.A 53.59,24.64 54.86,23.37
  Bottom 0.254: v66.04,30.23 v63.75,30.23 v59.69,30.23 | R15.1 R14.1 v10.16,14.22
  Bottom 0.305: v66.04,39.62 69.6,39.62 69.85,39.37 v69.85,37.85
  Bottom 0.406: v69.85,37.85 70.36,37.34 v70.36,25.15
  Bottom 0.61: Q2.2 9.16,14.22 v10.16,14.22 | v28.7,33.27 v32.26,33.27
5V
  Top 0.61: 51.88,19.75 51.88,20.19 | 51.88,20.19 50.67,20.19 50.38,19.9 C1.2 C3.1 50.38,15.91 51.05,15.24 52.83,15.24 53.09,14.99 U3.2 53.09,10.16 53.34,9.91 53.85,9.91 54.1,9.65 54.1,6.27 Q4.2 55.79,4.32 65.02,4.32 65.53,4.83 65.53,9.65 65,10.19 IC1.2 C7.2 | IC2.3 51.88,19.75 | 51.88,19.75 51.88,19.88 51.88,20.19 | 51.88,20.19 53.53,20.19 53.78,19.88 IC2.1
!RST
  Top 0.254: U1.17 19.08,20.61 19.3,20.83 19.3,28.19 15.24,32.26 14.22,32.26 SW1.1 12.95,32.51 12.49,32.97 R2.1
BTNA
  Bottom 0.406: JP13.2 54.36,3.12 54.36,4.06 53.85,4.57 51.31,4.57 44.45,11.43 44.26,11.43 43.12,11.94 41.91,11.94 U4.6
BTNB
  Bottom 0.406: JP13.1 50.48,3.05 U4.7
D+
  Top 0.406: R5.2 7.11,10.3 7.11,6.6 6.51,6 JP12.D+1
D-
  Top 0.406: R4.2 6.86,11.94 6.35,11.43 6.35,7.11 5.89,6.65 JP12.D-1
GND  (via drill 0.3)
  Top 0.254: U2.30 66.03,32.08 arc90 v65.28,32.83 | U2.17 63.46,35.05 64.01,35.05 64.26,34.8 | 64.26,34.8 v65.28,34.8 65.04,35.03 U2.18 | 64.26,34.8 64.26,33.85 v64.33,33.78 64.01,33.47 64.01,32.51 63.99,32.53 U2.23 | U2.8 67.79,35.53 v68.83,36.58 | U2.31 66.53,33.48 v66.23,33.78 | U1.31 21.4,16.13 v21.65,16.38 | U1.41 26.39,16.22 v26.54,16.38 | U1.11 15.89,23.61 v15.62,23.88 | U1.15 18.27,21.61 v18.29,21.59 | U1.97 20.39,29.22 v20.38,29.21 | U1.83 27.39,31.66 v27.56,32 | U1.55 v31.43,18.61 | U1.72 31.44,27.11 v31.18,26.86
  Top 0.406: JP12.GND1 5.65,4.7 v5.97,4.38
  other vias: 52.83,18.03 52.83,17.34 59.18,5.27 61.47,5.27 63.75,5.27 60.33,5.27 62.55,5.27 65.28,33.78 67.56,26.42 62.23,29.46 61.21,31.37 55.12,30.04 62.17,35.31 61.4,35.31 60.64,35.31 69.28,29.46 69.28,28.7 69.28,27.94 69.28,27.18 59.63,25.91 60.9,25.91 62.17,25.91 68.26,38.93 68.96,38.61 70.99,39.62 71.75,39.62 17.4,11.3 20.7,11.3 17.65,14.29 4.32,15.94 5.33,15.94 1.02,16.19 1.02,15.18 13.97,11.49 20.95,12.32 0.76,5.78 0.76,4.51 0.76,3.24 0.76,1.97 11.05,15.11 10.67,20.26 19.11,16.7 7.11,19.24 2.79,19.75 6.16,22.1 6.41,23.88 9.46,21.34 10.73,23.88 6.73,29.27 9.02,29.27 4.19,29.53 15.11,33.08 15.88,33.08 15.11,33.85 15.88,33.85 22.35,33.97 22.35,32.19 23.11,32.19 13.84,29.78 14.61,29.78 13.84,30.54 14.61,30.54 0.76,48.96 0.76,48.2 0.76,47.43 0.76,46.67 18.67,11.3 26.8,20.7 26.8,19.94 26.8,19.18 26.54,11.81 31.43,19.62 30.67,20.13 29.65,20.13 34.23,12 32.19,13.02 33.97,10.48 39.05,18.61 39.81,18.61 40.58,18.61 41.34,18.61 42.1,18.61 39.05,19.37 39.81,19.37 40.58,19.37 41.34,19.37 42.1,19.37 31.69,5.65 31.69,4.64 31.69,3.62 37.02,2.6 38.04,2.6 39.05,2.6 40.07,2.6 41.08,2.6 42.1,2.6 43.12,2.6 48.96,8.45 49.97,8.45 49.97,7.43 47.18,12 48.2,10.99 48.2,12 34.99,12 32.19,13.78 32.96,13.78 33.72,14.54 32.19,14.54 32.96,14.54 45.47,22.03 45.47,21.27 45.47,20.51 45.47,19.75 42.67,24.32 34.29,23.56 24.89,22.29 23.11,33.97 23.24,11.3 24.77,11.3 4.06,2.98 5.08,2.98 3.3,6.03 24.64,24.07 25.4,24.07 24.64,24.83 25.4,24.83 32,31.18 32.77,31.18 33.53,31.18 36.07,31.18 36.07,30.16 36.07,29.15 45.47,31.18 45.47,30.42 45.47,29.65 45.47,28.89 45.47,28.13 58.67,23.56 59.69,23.56 60.71,23.56 61.72,23.56 62.74,23.56 36.07,32.19 36.07,33.21 32,30.42 32.77,30.42 33.53,30.42 6.6,41.85 27.69,41.34 19.3,41.85 16.76,41.85 21.84,41.85 9.14,41.85 14.48,39.56 14.22,41.85 11.68,41.85 4.06,41.85 1.78,41.85 20.19,21.97 22.23,20.26 20.07,23.56
  pour Bottom: 83.82,51.56 -2.54,51.56 -2.54,-3.05 83.82,-3.05
  pour Top: -3.51,52.2 82.85,52.2 82.55,-1.78 -3.81,-1.78
ISP  (via drill 0.3)
  Top 0.254: R3.1 7.22,13.46 4.32,13.46 2.16,15.62 2.16,18 S1.1 3.13,17.02 v5.59,17.02 | v30.48,17.53 30.56,17.61 U1.53
  Bottom 0.254: v5.59,17.02 6.86,18.29 29.46,18.29 30.23,17.53 v30.48,17.53
N$1
  Top 0.254: R18.2 31.38,38.17 JP14.2
N$2
  Bottom 0.254: U4.1 SJ3.1
N$3
  Bottom 0.254: U4.3 38.09,8.64 SJ2.1
N$4
  Bottom 0.254: U4.5 40.63,8.64 SJ1.1
N$5  (via drill 0.61)
  Top 0.406: JP12.VBUS1 5.39,7.3 5.59,7.49
  Top 0.61: 5.59,7.49 5.59,9.14 5.33,9.4 v4.57,9.4
  Bottom 0.406: 2.29,8.89 F1.1
  Bottom 0.61: v4.57,9.4 2.79,9.4 2.29,8.89
N$6
  Top 0.254: JP11.2 32.77,42.67 32.51,42.42 R16.1
N$7
  Top 0.61: R1.2 LED1.C
N$11
  Top 0.254: R17.1 31.13,44.69 JP11.3
N$12  (via drill 0.3)
  Top 0.254: R6.1 8.78,18.94 v8.89,19.05 | v18.8,19.05 18.35,18.61 U1.21
  Top 0.406: R7.1 R6.1
  Bottom 0.254: v8.89,19.05 9.14,18.8 18.54,18.8 v18.8,19.05
N$13  (via drill 0.3)  (1 unrouted)
  Top 0.254: v20.07,16.26 20.39,15.93 U1.29
  Top 0.406: v9.65,10.67 R5.1
  Bottom 0.254: v9.65,10.67 9.91,10.67 9.91,12.95 10.41,13.4 20,13.4 20.32,13.72 20.32,16 v20.07,16.26
N$14
  Top 0.254: U1.32 21.89,13.53 R9.1
N$15
  Top 0.254: R9.2 LED2.C
N$16  (via drill 0.3)
  Top 0.254: R4.1 v10.67,11.94 | v20.83,16.76 20.89,16.7 U1.30
  Bottom 0.254: v20.83,16.76 20.83,13.4 20.32,12.89 11.43,12.89 10.67,12.13 v10.67,11.94
N$17
  Bottom 0.254: Q2.3 7.73,11.71 R8.1
N$18
  Top 0.61: U3.1 52.14,9.97 51.82,9.65 51.82,6.4 Q4.1
N$20
  Top 0.406: R13.1 R12.2 54.75,12.84 54.04,12.13 U3.3
N$21
  Top 0.254: U2.25 63.53,31.02 63.25,30.73 61.21,30.73 60.96,30.48 R11.2
N$22
  Top 0.254: U2.2 68.31,32.53 68.58,32.26 68.58,30.73 69.09,30.23 70.61,30.23 70.87,29.97 70.87,27.69 71.37,27.18 C26.2
N$23
  Top 0.254: U2.3 68.57,33.03 69.09,32.51 69.09,30.99 69.34,30.73 70.87,30.73 71.37,30.23 71.37,29.46 71.63,29.21 C28.2
N$24
  Top 0.254: U2.19 59.45,34.53 59.18,34.8 R10.1
N$25  (via drill 0.3)
  Top 0.254: L2.2 L4.1 | 56.95,33.02 L2.2 | U2.22 61.99,33.03 v61.72,32.77 | v59.69,33.27 56.97,33.27 L2.2
  Bottom 0.254: v61.72,32.77 60.2,32.77 v59.69,33.27
N$26
  Top 0.254: U2.21 60.96,33.53 59.94,32.51 58.42,32.51 57.96,32.05 L3.2 57.82,31.48 L4.2
N$29
  Top 0.254: L2.1 C19.1
N$30
  Top 0.254: C19.2 arc90 57.24,37.2 57.24,38.41 C18.1 arc-90 57.17,38.68 ANT1.P$1
P0  (via drill 0.3)
  Top 0.254: U1.7 18.08,25.61 v18.54,25.15 | v6.35,39.88 3.05,39.88 2.79,40.13 JP7.1
  Bottom 0.254: v18.54,25.15 19.3,25.91 19.3,27.18 18.54,27.94 6.35,27.94 6.1,28.19 6.1,39.62 v6.35,39.88
P1  (via drill 0.3)
  Top 0.254: U1.6 18.49,26.11 v18.54,26.16
  Bottom 0.254: v18.54,26.16 18.54,26.92 18.29,27.18 5.84,27.18 5.59,27.43 5.59,42.42 JP7.2
P2  (via drill 0.3)
  Top 0.254: U1.20 15.69,19.11 v15.37,19.43 | v7.87,21.84 v7.87,34.54
  Bottom 0.254: v15.37,19.43 9.53,19.43 7.87,20.57 v7.87,21.84 | v7.87,34.54 JP7.3
P3  (via drill 0.3)
  Top 0.254: U1.99 19.39,32.17 v17.53,34.04
  Bottom 0.254: v17.53,34.04 10.41,41.15 JP7.4
P4  (via drill 0.3)
  Top 0.254: U1.98 19.89,32.69 v18.8,33.78
  Bottom 0.254: v18.8,33.78 12.95,39.62 JP7.5
P5  (via drill 0.3)
  Top 0.254: U1.75 22.64,28.67 v22.39,28.41
  Bottom 0.254: v22.39,28.41 22.39,28.67 20.07,30.99 20.07,33.53 15.49,38.1 JP7.6
P6  (via drill 0.3)
  Top 0.254: U1.74 23.46,28.11 v23.2,27.85
  Bottom 0.254: v23.2,27.85 23.2,28.61 20.57,31.24 20.57,33.78 18.03,36.32 JP7.7
P7  (via drill 0.3)
  Top 0.254: U1.73 24.21,27.61 v23.96,27.35
  Bottom 0.254: v23.96,27.35 23.96,28.62 21.08,31.5 21.08,34.04 20.57,34.54 JP7.8
P8  (via drill 0.3)
  Top 0.254: U1.70 26.22,26.11 v25.96,25.85
  Bottom 0.254: v25.96,25.85 25.91,25.91 25.91,39.62 23.11,42.42 JP7.9
P9  (via drill 0.3)
  Top 0.254: U1.69 26.88,25.61 v26.67,25.4
  Bottom 0.254: v26.67,25.4 26.67,41.78 JP7.10
PACT  (via drill 0.3)
  Top 0.254: U2.6 68.12,34.53 v68.45,34.86 | U1.50 30.95,15.46 31.24,15.75 v33.78,15.75
  Bottom 0.254: v68.45,34.86 68.52,34.92 68.52,35.62 68.07,36.07 48.51,36.07 48.26,35.81 45.97,35.81 44.7,34.54 44.7,17.53 42.67,15.49 34.29,15.49 34.04,15.75 v33.78,15.75
PJB  (via drill 0.3)
  Top 0.254: JP10.1 6.86,25.65 v7.11,25.4 | U1.95 21.39,28.5 v21.34,28.45
  Bottom 0.254: v7.11,25.4 17.02,25.4 18.03,24.38 18.8,24.38 19.81,25.4 19.81,27.94 20.32,28.45 v21.34,28.45
PJX  (via drill 0.3)
  Top 0.254: U1.8 15.28,25.11 14.22,26.16 v13.4,26.16
  Bottom 0.254: v13.4,26.16 5.33,26.16 5.08,26.42 5.08,30.48 4.83,30.73 JP10.3
PJY  (via drill 0.3)
  Top 0.254: U1.9 14.76,24.61 v14.73,24.64
  Bottom 0.254: v14.73,24.64 4.83,24.64 4.57,24.89 4.57,27.94 4.32,28.19 JP10.2
PLG
  Top 0.254: U1.77 30.39,34.38 29.97,34.8 29.97,35.96 R18.1
PLR
  Top 0.254: U1.76 30.95,34 31.24,34.29 34.29,34.29 34.54,34.54 34.54,38.28 JP14.1
PMISO  (via drill 0.3)
  Top 0.254: U2.14 64.53,37.33 64.26,37.59 62.23,37.59 v61.98,37.34 | v25.65,17.02 25.91,17.27 25.91,21.08 26.43,21.61 U1.61 34.81,21.61 v35.05,21.84
  Top 0.61: JP2.3 JP5.3 JP8.3
  Bottom 0.254: v61.98,37.34 61.72,37.08 48.01,37.08 47.75,36.83 46.74,36.83 46.48,37.08 43.18,37.08 42.67,36.58 42.67,26.42 38.35,22.1 35.56,22.1 35.31,21.84 v35.05,21.84 | v25.65,17.02 25.65,9.27 JP2.3
PMOSI  (via drill 0.3)
  Top 0.254: U2.13 65.03,37.84 64.77,38.1 61.47,38.1 v61.21,37.85 | v27.94,16.76 27.94,20.57 28.47,21.11 U1.60 35.58,21.11 v35.81,21.34 | v43.43,36.32 v44.96,37.85
  Top 0.61: JP2.4 JP5.4 JP8.4
  Bottom 0.254: v27.94,16.76 27.94,8.76 JP2.4 | v35.81,21.34 36.07,21.59 38.61,21.59 43.18,26.16 43.18,36.07 v43.43,36.32 | v44.96,37.85 45.21,37.59 46.74,37.59 46.99,37.34 47.5,37.34 47.75,37.59 60.96,37.59 v61.21,37.85
PRDY  (via drill 0.3)
  Top 0.254: U2.16 63.53,36.8 63.25,37.08 62.99,37.08 v62.74,36.83 | U1.52 34.96,17.11 v35.31,16.76
  Bottom 0.254: v62.74,36.83 62.48,36.58 48.26,36.58 48.01,36.32 46.48,36.32 46.23,36.58 44.7,36.58 43.69,35.56 43.69,18.03 42.16,16.51 35.81,16.51 35.56,16.76 v35.31,16.76
PREQ  (via drill 0.3)
  Top 0.254: U2.12 65.53,38.36 65.28,38.61 60.71,38.61 v60.45,38.35 | U1.51 34.25,16.55 v34.54,16.26 | v44.7,35.56 v47.24,38.1
  Bottom 0.254: v60.45,38.35 60.2,38.1 v47.24,38.1 | v34.54,16.26 34.8,16.26 35.05,16 42.42,16 44.2,17.78 44.2,35.05 v44.7,35.56
PSCK  (via drill 0.3)
  Top 0.254: U2.11 66.03,38.62 65.53,39.12 59.94,39.12 v59.69,38.86 | v24.89,16.51 24.89,21.08 25.92,22.11 U1.62 34.04,22.11 v34.29,22.35
  Top 0.61: JP2.2 JP5.2 JP8.2
  Bottom 0.254: v59.69,38.86 59.44,38.61 47.75,38.61 47.5,38.86 46.99,38.86 46.61,38.48 43.31,38.48 42.16,37.34 42.16,26.67 38.1,22.61 34.8,22.61 34.54,22.35 v34.29,22.35 | v24.89,16.51 23.11,16.51 22.35,15.75 JP2.2
PSCL  (via drill 0.3)
  Top 0.254: U1.24 18.2,17.11 18.29,17.02 18.29,16 17.53,15.24 v17.27,15.24 | v15.24,15.24 15.24,12.7 v14.73,12.19
  Top 0.61: JP9.2 JP6.2 JP3.2
  Bottom 0.254: R15.2 14.99,15.49 v15.24,15.24 v17.27,15.24 | v14.73,12.19 11.94,12.19 11.43,11.68 JP3.2
PSDA  (via drill 0.3)
  Top 0.254: U1.25 16.29,16.55 16,16.26 16,14.48 v16.26,14.22 v16.26,12.19
  Top 0.61: JP9.3 JP6.3 JP3.3
  Bottom 0.254: v16.26,14.22 R14.2 | JP3.3 16.26,10.86 v16.26,12.19
PSW
  Top 0.254: U1.78 29.89,34.12 28.96,35.05 28.96,41.54 R16.2
RX2  (via drill 0.3)
  Top 0.254: U1.49 30.39,12.47 v30.92,11.94
  Bottom 0.254: SJ3.2 35.31,7.11 33.53,7.11 33.27,7.37 33.27,10.67 32.51,11.43 31.24,11.43 30.92,11.75 v30.92,11.94
RXT1
  Top 0.254: U1.16 15.47,21.11 14.99,21.59 14.78,21.59 Y1.1 13.97,22.1 13.21,22.86 13.21,25.4 12.95,25.65 9.51,25.65 C11.1
RXT2
  Top 0.254: U1.18 15.2,20.11 14.73,20.57 12.45,20.57 11.94,21.08 11.94,22.1 Y1.4 10.62,22.61 10.16,22.61 10.05,22.72 C10.1
TX2  (via drill 0.3)
  Top 0.254: U1.48 29.89,12.02 v29.91,11.94
  Bottom 0.254: SJ2.2 38.35,6.86 38.1,6.6 33.27,6.6 32.77,7.11 32.77,10.41 32.26,10.92 30.42,10.92 29.91,11.43 v29.91,11.94
TX3  (via drill 0.3)
  Top 0.254: v28.89,11.94 28.89,12 U1.46
  Bottom 0.254: SJ1.2 40.89,6.35 40.64,6.1 33.02,6.1 32.26,6.86 32.26,9.91 32,10.16 29.21,10.16 28.89,10.48 v28.89,11.94
USBC  (via drill 0.3)
  Top 0.254: v23.37,17.53 23.88,17.53 24.13,17.78 24.13,22.86 24.38,23.11 U1.64
  Bottom 0.254: Q2.1 7.18,17.34 7.62,17.78 23.11,17.78 v23.37,17.53
VBAT  (via drill 0.3)
  Top 0.254: U1.19 18.34,19.61 18.54,19.81 v19.81,19.81
  Bottom 0.254: v19.81,19.81 21.81,21.81 BT1.1
VCC  (via drill 0.41, 0.61)
  Top 0.406: Q4.3 53.09,8.34 v53.09,7.62 | v5.59,14.48 R7.2
  Bottom 0.406: F1.2 0.9,6.97 0.51,7.37 0.51,13.46 1.52,14.48 v5.59,14.48
  Bottom 0.61: F1.2 2.29,2.03 2.79,1.52 55.63,1.52 55.88,1.78 55.88,7.37 55.63,7.62 v53.09,7.62
VDD_PA  (via drill 0.3)
  Top 0.254: U2.20 v58.68,34.03 v58.67,34.04 | 58.42,30.31 C20.1 58.8,30.04 v58.8,30.86 58.88,30.94 L3.1
  Bottom 0.254: v58.67,34.04 58.42,33.78 58.42,31.24 v58.8,30.86
VDDA  (via drill 0.3)
  Top 0.254: U1.10 18.06,24.11 18.29,23.88 18.29,23.37 18.03,23.11 U1.12 14.74,23.11 v14.49,23.36 | C17.2 2.5,22.99 L1.P$2 4.45,23.11 v5.33,23.11
  Bottom 0.254: v14.49,23.36 14.24,23.11 14.22,23.11 5.34,23.11 v5.33,23.11
VIN  (via drill 0.61)
  Top 0.406: R13.2 v56.64,9.65
  Top 0.61: IC1.1 58.65,9.65 | 58.65,9.65 v56.64,9.65 | 58.65,9.65 59.18,9.12 C2.2 59.23,8.01 C4.1
  Bottom 0.61: C5.1 66.8,9.65 v56.64,9.65 47.49,9.65 44.45,12.7 U4.8
XC1
  Top 0.254: U2.28 65.03,30.22 65.53,29.72 65.53,28.68 Q3.3 66.38,28.59 C24.1
XC2
  Top 0.254: U2.27 64.53,29.96 64.77,29.72 64.77,27.69 64.12,27.04 Q3.1 63.48,27.29 C23.1
XL1
  Top 0.254: U2.5 69.08,34.03 69.85,34.8
  Top 0.305: 69.85,34.8 69.85,35.1 Y2.4 70.61,35.86 70.61,36.32 71.12,36.83 C22.1
XL2
  Top 0.254: U2.4 69.59,33.53 70.1,33.02 70.1,32.72 Y2.1 70.61,32.21 70.61,31.75 70.87,31.5 71.88,31.5 71.99,31.38 C21.1
XT1
  Top 0.254: U1.22 14.57,18.11 Q1.3 13.86,18.82 C13.1
XT2
  Top 0.254: U1.23 15.96,17.61 15.62,17.27 13.01,17.27 Q1.1 12.11,15.56 C12.1

### Text on the board
tPlace: G | PSW | V | S | P0 | P1 | P2 | P3 | P4 | P5 | P6 | P7 | P8 | P9 | PLG | PLR | DAC | RX0 | TX0 | TX1 | RX1 | ANALOG | PWM | V | G | PJX | RST | PJY | PJB | PWR | OpenChair | ISP | MajinStudios | V | G | V | PSDA | PMISO | G | PSCL | PSCK | PMOSI | BUTTON
bPlace: (39;39) | (77;28) | Alvaro Ferran | (37;25) | (40;4) | (77;3) | Y | X